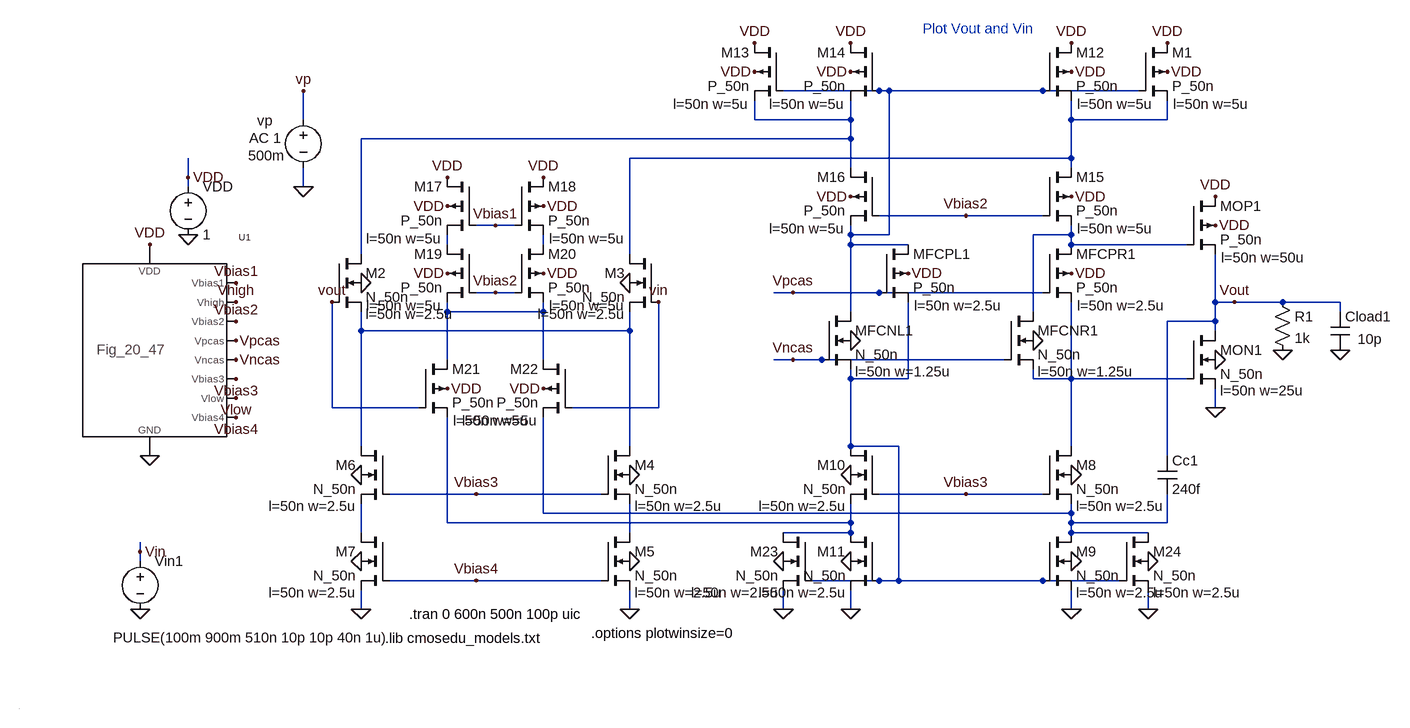
[diagram p0: schematic Fig24_49.asc]
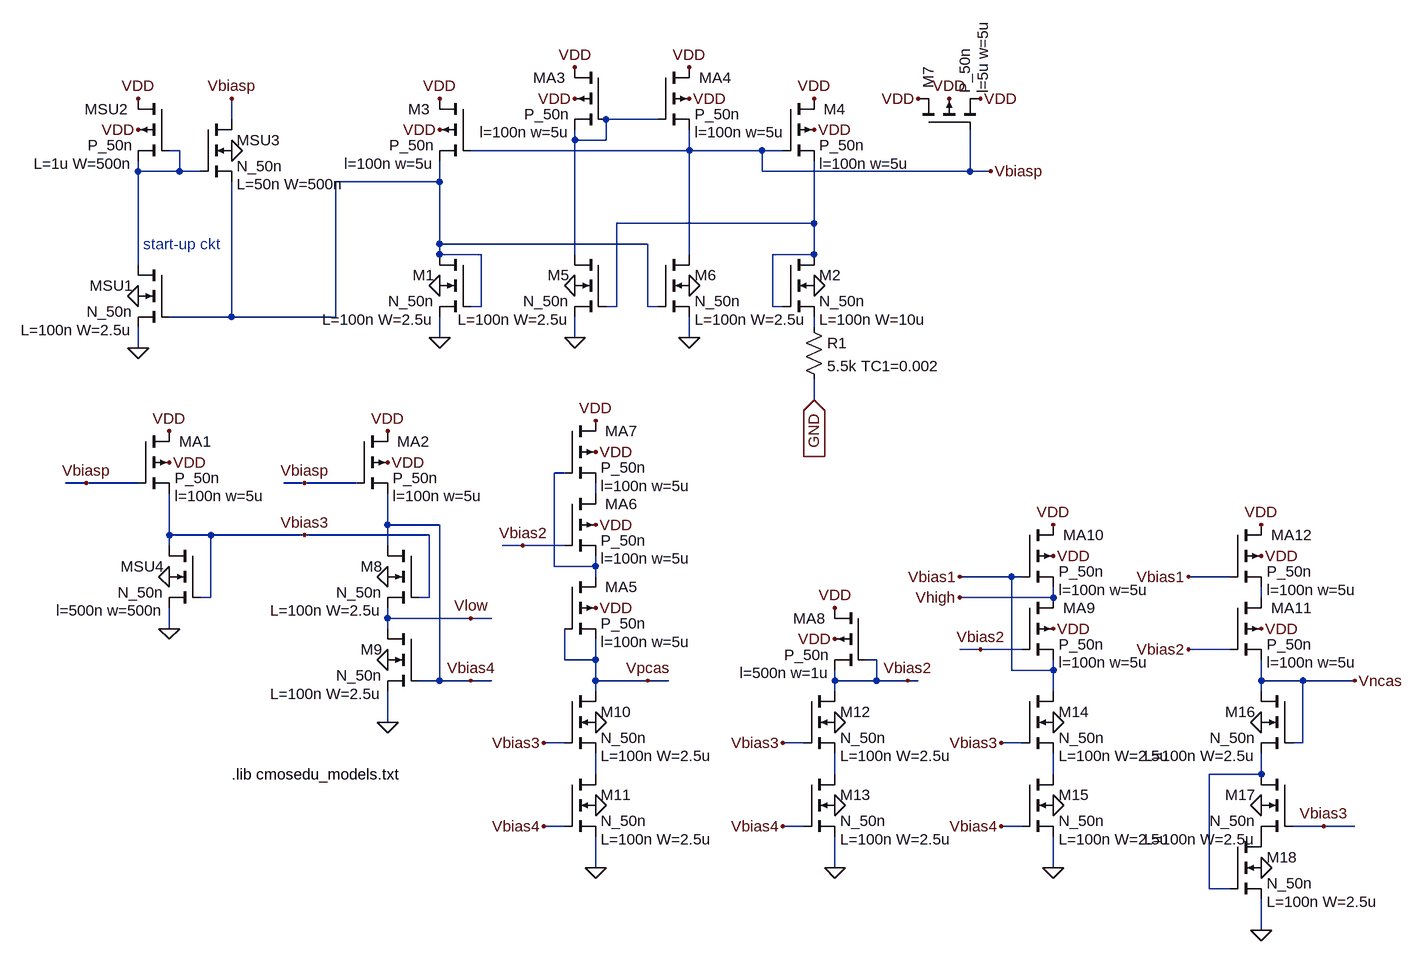
[diagram p1: sub-circuit fig_20_47.asc]
Fig24_49.asc, the LTspice schematic file:
Version 4
SHEET 1 3376 680
WIRE 2512 -1120 2352 -1120
WIRE 2528 -1120 2512 -1120
WIRE 2784 -1120 2528 -1120
WIRE 2944 -1120 2784 -1120
WIRE 1552 -1072 1552 -1120
WIRE 2304 -1072 2304 -1104
WIRE 2464 -1072 2464 -1104
WIRE 2464 -1072 2304 -1072
WIRE 2832 -1072 2832 -1104
WIRE 2992 -1072 2992 -1104
WIRE 2992 -1072 2832 -1072
WIRE 2464 -1040 2464 -1072
WIRE 2464 -1040 1648 -1040
WIRE 2832 -1008 2832 -1072
WIRE 2832 -1008 2096 -1008
WIRE 2464 -992 2464 -1040
WIRE 2832 -992 2832 -1008
WIRE 1360 -976 1360 -1008
WIRE 1360 -960 1360 -976
WIRE 1552 -960 1552 -992
WIRE 2656 -912 2512 -912
WIRE 2784 -912 2656 -912
WIRE 1872 -896 1840 -896
WIRE 1904 -896 1872 -896
WIRE 2464 -880 2464 -896
WIRE 2528 -880 2528 -1120
WIRE 2528 -880 2464 -880
WIRE 2832 -880 2832 -896
WIRE 2832 -880 2768 -880
WIRE 1792 -864 1792 -880
WIRE 1952 -864 1952 -880
WIRE 2464 -864 2464 -880
WIRE 2560 -864 2464 -864
WIRE 2832 -864 2832 -880
WIRE 3024 -864 2832 -864
WIRE 1648 -848 1648 -1040
WIRE 2096 -848 2096 -1008
WIRE 1872 -784 1840 -784
WIRE 1904 -784 1872 -784
WIRE 2368 -784 2336 -784
WIRE 2512 -784 2368 -784
WIRE 2784 -784 2512 -784
WIRE 3072 -768 3072 -848
WIRE 3104 -768 3072 -768
WIRE 3184 -768 3104 -768
WIRE 3280 -768 3184 -768
WIRE 1792 -752 1792 -768
WIRE 1952 -752 1952 -768
WIRE 1952 -752 1792 -752
WIRE 2464 -752 2464 -864
WIRE 2768 -752 2768 -880
WIRE 3280 -752 3280 -768
WIRE 3072 -736 3072 -768
WIRE 3072 -736 2992 -736
WIRE 1648 -720 1648 -752
WIRE 2096 -720 2096 -752
WIRE 2096 -720 1648 -720
WIRE 3072 -720 3072 -736
WIRE 1792 -672 1792 -752
WIRE 1952 -672 1952 -752
WIRE 2368 -672 2336 -672
WIRE 2416 -672 2368 -672
WIRE 2720 -672 2416 -672
WIRE 2464 -640 2464 -656
WIRE 2560 -640 2560 -768
WIRE 2560 -640 2464 -640
WIRE 2768 -640 2768 -656
WIRE 2832 -640 2832 -768
WIRE 2832 -640 2768 -640
WIRE 3024 -640 2832 -640
WIRE 1600 -592 1600 -768
WIRE 1744 -592 1600 -592
WIRE 2144 -592 2144 -768
WIRE 2144 -592 2000 -592
WIRE 3072 -592 3072 -624
WIRE 1792 -400 1792 -576
WIRE 1648 -528 1648 -720
WIRE 2096 -528 2096 -720
WIRE 2464 -528 2464 -640
WIRE 2544 -528 2464 -528
WIRE 2832 -528 2832 -640
WIRE 2992 -512 2992 -736
WIRE 1840 -448 1696 -448
WIRE 2048 -448 1840 -448
WIRE 2656 -448 2512 -448
WIRE 2784 -448 2656 -448
WIRE 1952 -416 1952 -576
WIRE 2832 -416 2832 -432
WIRE 2832 -416 1952 -416
WIRE 2464 -400 2464 -432
WIRE 2464 -400 1792 -400
WIRE 2832 -400 2832 -416
WIRE 2992 -400 2992 -448
WIRE 2992 -400 2832 -400
WIRE 1648 -384 1648 -432
WIRE 2096 -384 2096 -432
WIRE 2464 -384 2464 -400
WIRE 2464 -384 2352 -384
WIRE 2832 -384 2832 -400
WIRE 2960 -384 2832 -384
WIRE 1280 -352 1280 -368
WIRE 1280 -336 1280 -352
WIRE 1840 -304 1696 -304
WIRE 2048 -304 1840 -304
WIRE 2512 -304 2400 -304
WIRE 2544 -304 2544 -528
WIRE 2544 -304 2512 -304
WIRE 2784 -304 2544 -304
WIRE 2912 -304 2784 -304
WIRE 1648 -256 1648 -288
WIRE 2096 -256 2096 -288
WIRE 2352 -256 2352 -288
WIRE 2464 -256 2464 -288
WIRE 2832 -256 2832 -288
WIRE 2960 -256 2960 -288
WIRE 0 0 0 0
FLAG 1360 -880 0
FLAG 1360 -976 VDD
FLAG 1296 -864 VDD
FLAG 1296 -512 0
FLAG 1440 -800 Vbias1
FLAG 1440 -768 Vhigh
FLAG 1440 -736 Vbias2
FLAG 1440 -640 Vbias3
FLAG 1440 -704 Vpcas
FLAG 1440 -672 Vncas
FLAG 1440 -576 Vbias4
FLAG 1440 -608 Vlow
FLAG 1552 -960 0
FLAG 1552 -1120 vp
FLAG 1280 -256 0
FLAG 1280 -352 Vin
FLAG 2992 -1152 VDD
FLAG 1648 -800 0
FLAG 2096 -800 0
FLAG 1600 -768 vout
FLAG 2144 -768 vin
FLAG 2096 -480 0
FLAG 2096 -336 0
FLAG 2096 -256 0
FLAG 1648 -480 0
FLAG 1648 -336 0
FLAG 1648 -256 0
FLAG 1840 -448 Vbias3
FLAG 1840 -304 Vbias4
FLAG 2832 -480 0
FLAG 2832 -336 0
FLAG 2832 -256 0
FLAG 2464 -480 0
FLAG 2464 -336 0
FLAG 2464 -256 0
FLAG 2656 -448 Vbias3
FLAG 2832 -1152 VDD
FLAG 2832 -1200 VDD
FLAG 2992 -1200 VDD
FLAG 2304 -1152 VDD
FLAG 2464 -1152 VDD
FLAG 2464 -1200 VDD
FLAG 2304 -1200 VDD
FLAG 2832 -944 VDD
FLAG 2464 -944 VDD
FLAG 2656 -912 Vbias2
FLAG 3280 -688 0
FLAG 3104 -768 Vout
FLAG 2560 -816 VDD
FLAG 2832 -816 VDD
FLAG 2768 -704 0
FLAG 2464 -704 0
FLAG 2368 -784 Vpcas
FLAG 2368 -672 Vncas
FLAG 3072 -896 VDD
FLAG 3072 -944 VDD
FLAG 3072 -672 0
FLAG 3072 -592 0
FLAG 1792 -928 VDD
FLAG 1792 -976 VDD
FLAG 1952 -928 VDD
FLAG 1952 -976 VDD
FLAG 1792 -816 VDD
FLAG 1952 -816 VDD
FLAG 1872 -896 Vbias1
FLAG 1872 -784 Vbias2
FLAG 1792 -624 VDD
FLAG 1952 -624 VDD
FLAG 2352 -336 0
FLAG 2352 -256 0
FLAG 2960 -336 0
FLAG 2960 -256 0
FLAG 3184 -688 0
SYMBOL voltage 1360 -976 R0
WINDOW 123 0 0 Left 0
WINDOW 39 0 0 Left 0
SYMATTR InstName VDD
SYMATTR Value 1
SYMBOL Fig_20_47 1296 -688 R0
SYMATTR InstName U1
SYMBOL voltage 1552 -1088 R0
WINDOW 0 -77 18 Left 0
WINDOW 3 -92 76 Left 0
WINDOW 123 -90 47 Left 0
WINDOW 39 0 0 Left 0
SYMATTR InstName vp
SYMATTR Value 500m
SYMATTR Value2 AC 1
SYMBOL voltage 1280 -352 R0
WINDOW 3 -45 143 Left 0
WINDOW 123 0 0 Left 0
WINDOW 39 0 0 Left 0
SYMATTR Value PULSE(100m 900m 510n 10p 10p 40n 1u)
SYMATTR InstName Vin1
SYMBOL pmos4 2944 -1200 R0
WINDOW 123 58 102 Left 0
WINDOW 0 56 16 Left 0
SYMATTR Value2 l=50n w=5u
SYMATTR InstName M1
SYMATTR Value P_50n
SYMBOL nmos4 1600 -848 R0
WINDOW 123 56 100 Left 0
SYMATTR Value2 l=50n w=2.5u
SYMATTR InstName M2
SYMATTR Value N_50n
SYMBOL nmos4 2144 -848 M0
WINDOW 123 56 100 Left 0
SYMATTR Value2 l=50n w=2.5u
SYMATTR InstName M3
SYMATTR Value N_50n
SYMBOL nmos4 2048 -528 R0
WINDOW 123 56 100 Left 0
SYMATTR Value2 l=50n w=2.5u
SYMATTR InstName M4
SYMATTR Value N_50n
SYMBOL nmos4 2048 -384 R0
WINDOW 123 56 100 Left 0
SYMATTR Value2 l=50n w=2.5u
SYMATTR InstName M5
SYMATTR Value N_50n
SYMBOL nmos4 1696 -528 M0
WINDOW 123 56 100 Left 0
SYMATTR Value2 l=50n w=2.5u
SYMATTR InstName M6
SYMATTR Value N_50n
SYMBOL nmos4 1696 -384 M0
WINDOW 123 56 100 Left 0
SYMATTR Value2 l=50n w=2.5u
SYMATTR InstName M7
SYMATTR Value N_50n
SYMBOL nmos4 2784 -528 R0
WINDOW 123 56 100 Left 0
SYMATTR Value2 l=50n w=2.5u
SYMATTR InstName M8
SYMATTR Value N_50n
SYMBOL nmos4 2784 -384 R0
WINDOW 123 56 100 Left 0
SYMATTR Value2 l=50n w=2.5u
SYMATTR InstName M9
SYMATTR Value N_50n
SYMBOL nmos4 2512 -528 M0
WINDOW 123 56 100 Left 0
SYMATTR Value2 l=50n w=2.5u
SYMATTR InstName M10
SYMATTR Value N_50n
SYMBOL nmos4 2512 -384 M0
WINDOW 123 56 100 Left 0
SYMATTR Value2 l=50n w=2.5u
SYMATTR InstName M11
SYMATTR Value N_50n
SYMBOL pmos4 2784 -1200 R0
WINDOW 123 58 102 Left 0
WINDOW 0 56 16 Left 0
SYMATTR Value2 l=50n w=5u
SYMATTR InstName M12
SYMATTR Value P_50n
SYMBOL pmos4 2352 -1200 M0
WINDOW 123 58 102 Left 0
WINDOW 0 56 16 Left 0
SYMATTR Value2 l=50n w=5u
SYMATTR InstName M13
SYMATTR Value P_50n
SYMBOL pmos4 2512 -1200 M0
WINDOW 123 58 102 Left 0
WINDOW 0 56 16 Left 0
SYMATTR Value2 l=50n w=5u
SYMATTR InstName M14
SYMATTR Value P_50n
SYMBOL pmos4 2784 -992 R0
WINDOW 123 58 102 Left 0
WINDOW 0 56 16 Left 0
SYMATTR Value2 l=50n w=5u
SYMATTR InstName M15
SYMATTR Value P_50n
SYMBOL pmos4 2512 -992 M0
WINDOW 123 58 102 Left 0
WINDOW 0 56 16 Left 0
SYMATTR Value2 l=50n w=5u
SYMATTR InstName M16
SYMATTR Value P_50n
SYMBOL cap 3264 -752 R0
WINDOW 3 45 46 Left 0
SYMATTR Value 10p
SYMATTR InstName Cload1
SYMBOL pmos4 2512 -864 R0
WINDOW 123 58 102 Left 0
WINDOW 0 56 16 Left 0
SYMATTR Value2 l=50n w=2.5u
SYMATTR InstName MFCPL1
SYMATTR Value P_50n
SYMBOL pmos4 2784 -864 R0
WINDOW 123 58 102 Left 0
WINDOW 0 56 16 Left 0
SYMATTR Value2 l=50n w=2.5u
SYMATTR InstName MFCPR1
SYMATTR Value P_50n
SYMBOL nmos4 2720 -752 R0
WINDOW 123 56 100 Left 0
SYMATTR Value2 l=50n w=1.25u
SYMATTR InstName MFCNR1
SYMATTR Value N_50n
SYMBOL nmos4 2416 -752 R0
WINDOW 123 56 100 Left 0
SYMATTR Value2 l=50n w=1.25u
SYMATTR InstName MFCNL1
SYMATTR Value N_50n
SYMBOL pmos4 3024 -944 R0
WINDOW 123 58 102 Left 0
WINDOW 0 56 16 Left 0
SYMATTR Value2 l=50n w=50u
SYMATTR InstName MOP1
SYMATTR Value P_50n
SYMBOL nmos4 3024 -720 R0
WINDOW 123 56 100 Left 0
SYMATTR Value2 l=50n w=25u
SYMATTR InstName MON1
SYMATTR Value N_50n
SYMBOL cap 2976 -512 R0
SYMATTR InstName Cc1
SYMATTR Value 240f
SYMBOL pmos4 1840 -976 M0
WINDOW 123 58 102 Left 0
WINDOW 0 56 16 Left 0
SYMATTR Value2 l=50n w=5u
SYMATTR InstName M17
SYMATTR Value P_50n
SYMBOL pmos4 1904 -976 R0
WINDOW 123 58 102 Left 0
WINDOW 0 56 16 Left 0
SYMATTR Value2 l=50n w=5u
SYMATTR InstName M18
SYMATTR Value P_50n
SYMBOL pmos4 1840 -864 M0
WINDOW 123 58 102 Left 0
WINDOW 0 56 16 Left 0
SYMATTR Value2 l=50n w=5u
SYMATTR InstName M19
SYMATTR Value P_50n
SYMBOL pmos4 1904 -864 R0
WINDOW 123 58 102 Left 0
WINDOW 0 56 16 Left 0
SYMATTR Value2 l=50n w=5u
SYMATTR InstName M20
SYMATTR Value P_50n
SYMBOL pmos4 1744 -672 R0
WINDOW 123 58 102 Left 0
WINDOW 0 56 16 Left 0
SYMATTR Value2 l=50n w=5u
SYMATTR InstName M21
SYMATTR Value P_50n
SYMBOL pmos4 2000 -672 M0
WINDOW 123 58 102 Left 0
WINDOW 0 56 16 Left 0
SYMATTR Value2 l=50n w=5u
SYMATTR InstName M22
SYMATTR Value P_50n
SYMBOL nmos4 2400 -384 M0
WINDOW 123 56 100 Left 0
SYMATTR Value2 l=50n w=2.5u
SYMATTR InstName M23
SYMATTR Value N_50n
SYMBOL nmos4 2912 -384 R0
WINDOW 123 56 100 Left 0
SYMATTR Value2 l=50n w=2.5u
SYMATTR InstName M24
SYMATTR Value N_50n
SYMBOL res 3168 -784 R0
SYMATTR InstName R1
SYMATTR Value 1k
TEXT 1688 -208 Left 0 !.lib cmosedu_models.txt
TEXT 1728 -248 Left 0 !.tran 0 600n 500n 100p uic
TEXT 2584 -1224 Left 0 ;Plot Vout and Vin
TEXT 2032 -216 Left 0 !.options plotwinsize=0

fig_20_47.asc, the sub-circuit schematic file:
Version 4
SHEET 1 2508 1124
WIRE 464 416 432 416
WIRE 544 -64 544 -80
WIRE 544 80 544 -64
WIRE 544 208 544 176
WIRE 544 416 464 416
WIRE 592 496 592 432
WIRE 592 512 592 496
WIRE 592 640 592 608
WIRE 608 -96 592 -96
WIRE 608 -64 544 -64
WIRE 608 -64 608 -96
WIRE 640 -64 608 -64
WIRE 656 496 592 496
WIRE 656 592 640 592
WIRE 656 592 656 496
WIRE 688 -144 688 -176
WIRE 688 160 592 160
WIRE 688 160 688 -48
WIRE 800 416 768 416
WIRE 800 496 656 496
WIRE 848 160 688 160
WIRE 848 160 848 -48
WIRE 880 416 800 416
WIRE 928 480 928 432
WIRE 928 512 928 480
WIRE 928 624 928 608
WIRE 928 640 928 624
WIRE 928 784 928 736
WIRE 992 496 800 496
WIRE 992 592 976 592
WIRE 992 592 992 496
WIRE 1008 -48 848 -48
WIRE 1008 -48 1008 -80
WIRE 1008 48 1008 -48
WIRE 1008 64 1008 48
WIRE 1008 192 1008 160
WIRE 1008 480 928 480
WIRE 1008 720 976 720
WIRE 1008 720 1008 480
WIRE 1056 624 928 624
WIRE 1056 720 1008 720
WIRE 1072 64 1008 64
WIRE 1072 144 1056 144
WIRE 1072 144 1072 64
WIRE 1088 624 1056 624
WIRE 1088 720 1056 720
WIRE 1136 512 1104 512
WIRE 1184 544 1184 400
WIRE 1200 400 1184 400
WIRE 1200 512 1136 512
WIRE 1200 688 1200 640
WIRE 1200 816 1168 816
WIRE 1200 944 1168 944
WIRE 1216 -112 1216 -128
WIRE 1216 64 1216 -112
WIRE 1216 192 1216 160
WIRE 1248 432 1248 416
WIRE 1248 544 1184 544
WIRE 1248 544 1248 528
WIRE 1248 560 1248 544
WIRE 1248 688 1200 688
WIRE 1248 688 1248 656
WIRE 1248 720 1248 688
WIRE 1248 736 1248 720
WIRE 1248 864 1248 832
WIRE 1248 1008 1248 960
WIRE 1264 -112 1216 -112
WIRE 1264 -112 1264 -144
WIRE 1280 144 1264 144
WIRE 1280 144 1280 16
WIRE 1328 48 1008 48
WIRE 1328 144 1328 48
WIRE 1328 720 1248 720
WIRE 1344 -144 1264 -144
WIRE 1344 144 1328 144
WIRE 1360 720 1328 720
WIRE 1392 -96 1056 -96
WIRE 1392 -96 1392 -128
WIRE 1392 64 1392 -96
WIRE 1392 192 1392 160
WIRE 1504 -96 1392 -96
WIRE 1504 -64 1504 -96
WIRE 1520 144 1520 64
WIRE 1536 -96 1504 -96
WIRE 1536 144 1520 144
WIRE 1568 816 1536 816
WIRE 1568 944 1536 944
WIRE 1584 16 1280 16
WIRE 1584 16 1584 -80
WIRE 1584 64 1520 64
WIRE 1584 64 1584 16
WIRE 1584 176 1584 160
WIRE 1584 288 1584 256
WIRE 1616 720 1616 704
WIRE 1616 736 1616 720
WIRE 1616 864 1616 832
WIRE 1616 1008 1616 960
WIRE 1680 688 1664 688
WIRE 1680 720 1616 720
WIRE 1680 720 1680 688
WIRE 1728 720 1680 720
WIRE 1744 720 1728 720
WIRE 1824 -64 1504 -64
WIRE 1824 -64 1824 -128
WIRE 1840 672 1808 672
WIRE 1856 -64 1824 -64
WIRE 1888 560 1808 560
WIRE 1888 704 1888 560
WIRE 1904 560 1888 560
WIRE 1904 672 1840 672
WIRE 1904 816 1872 816
WIRE 1904 944 1872 944
WIRE 1952 592 1808 592
WIRE 1952 592 1952 576
WIRE 1952 704 1888 704
WIRE 1952 704 1952 688
WIRE 1952 736 1952 704
WIRE 1952 864 1952 832
WIRE 1952 1008 1952 960
WIRE 2192 1040 2192 864
WIRE 2224 560 2160 560
WIRE 2224 672 2160 672
WIRE 2224 1040 2192 1040
WIRE 2272 592 2272 576
WIRE 2272 720 2272 688
WIRE 2272 736 2272 720
WIRE 2272 864 2192 864
WIRE 2272 864 2272 832
WIRE 2272 880 2272 864
WIRE 2272 1104 2272 1056
WIRE 2336 720 2272 720
WIRE 2336 816 2320 816
WIRE 2336 816 2336 720
WIRE 2368 944 2320 944
WIRE 2416 720 2336 720
WIRE 2416 944 2368 944
FLAG 544 -128 VDD
FLAG 544 -176 VDD
FLAG 544 208 0
FLAG 544 128 0
FLAG 688 -96 0
FLAG 688 -176 Vbiasp
FLAG 1008 -128 VDD
FLAG 1008 -176 VDD
FLAG 1584 -128 VDD
FLAG 1584 -176 VDD
FLAG 1856 -64 Vbiasp
FLAG 1008 192 0
FLAG 1008 112 0
FLAG 1584 112 0
FLAG 1392 -176 VDD
FLAG 1392 -224 VDD
FLAG 1216 -176 VDD
FLAG 1216 -224 VDD
FLAG 1216 112 0
FLAG 1392 112 0
FLAG 1216 192 0
FLAG 1392 192 0
FLAG 1792 -176 VDD
FLAG 1744 -176 VDD
FLAG 1840 -176 VDD
FLAG 592 384 VDD
FLAG 592 336 VDD
FLAG 464 416 Vbiasp
FLAG 928 384 VDD
FLAG 928 336 VDD
FLAG 800 416 Vbiasp
FLAG 592 640 0
FLAG 592 560 0
FLAG 928 560 0
FLAG 928 688 0
FLAG 928 784 0
FLAG 800 496 Vbias3
FLAG 1248 784 0
FLAG 1248 912 0
FLAG 1248 1008 0
FLAG 1056 624 Vlow
FLAG 1056 720 Vbias4
FLAG 1168 816 Vbias3
FLAG 1168 944 Vbias4
FLAG 1616 784 0
FLAG 1616 912 0
FLAG 1616 1008 0
FLAG 1536 816 Vbias3
FLAG 1536 944 Vbias4
FLAG 1952 784 0
FLAG 1952 912 0
FLAG 1952 1008 0
FLAG 1872 816 Vbias3
FLAG 1872 944 Vbias4
FLAG 1248 608 VDD
FLAG 1328 720 Vpcas
FLAG 1248 480 VDD
FLAG 1248 368 VDD
FLAG 1248 320 VDD
FLAG 1136 512 Vbias2
FLAG 1616 656 VDD
FLAG 1616 608 VDD
FLAG 1728 720 Vbias2
FLAG 1952 640 VDD
FLAG 1952 528 VDD
FLAG 1952 480 VDD
FLAG 1840 672 Vbias2
FLAG 1808 560 Vbias1
FLAG 1808 592 Vhigh
FLAG 2272 640 VDD
FLAG 2272 528 VDD
FLAG 2272 480 VDD
FLAG 2160 560 Vbias1
FLAG 2160 672 Vbias2
FLAG 2272 784 0
FLAG 2272 912 0
FLAG 2272 1008 0
FLAG 2272 1104 0
FLAG 2416 720 Vncas
FLAG 2368 944 Vbias3
FLAG 1584 288 GND
IOPIN 1584 288 In
SYMBOL pmos4 592 -176 M0
WINDOW 0 63 16 Left 0
WINDOW 123 56 100 Left 0
SYMATTR InstName MSU2
SYMATTR Value2 L=1u W=500n
SYMATTR Value P_50n
SYMBOL nmos4 592 80 M0
WINDOW 123 56 100 Left 0
SYMATTR Value2 L=100n W=2.5u
SYMATTR InstName MSU1
SYMATTR Value N_50n
SYMBOL nmos4 640 -144 R0
WINDOW 123 56 100 Left 0
SYMATTR Value2 L=50n W=500n
SYMATTR InstName MSU3
SYMATTR Value N_50n
SYMBOL pmos4 1056 -176 M0
WINDOW 0 63 16 Left 0
WINDOW 123 56 100 Left 0
SYMATTR InstName M3
SYMATTR Value2 l=100n w=5u
SYMATTR Value P_50n
SYMBOL pmos4 1536 -176 R0
WINDOW 0 63 16 Left 0
WINDOW 123 56 100 Left 0
SYMATTR InstName M4
SYMATTR Value2 l=100n w=5u
SYMATTR Value P_50n
SYMBOL nmos4 1056 64 M0
WINDOW 123 56 100 Left 0
SYMATTR Value2 L=100n W=2.5u
SYMATTR InstName M1
SYMATTR Value N_50n
SYMBOL nmos4 1536 64 R0
WINDOW 123 56 100 Left 0
SYMATTR Value2 L=100n W=10u
SYMATTR InstName M2
SYMATTR Value N_50n
SYMBOL res 1568 160 R0
SYMATTR InstName R1
SYMATTR Value 5.5k TC1=0.002
SYMBOL pmos4 1344 -224 R0
WINDOW 0 63 16 Left 0
WINDOW 123 56 100 Left 0
SYMATTR InstName MA4
SYMATTR Value2 l=100n w=5u
SYMATTR Value P_50n
SYMBOL pmos4 1264 -224 M0
WINDOW 0 63 16 Left 0
WINDOW 123 56 100 Left 0
SYMATTR InstName MA3
SYMATTR Value2 l=100n w=5u
SYMATTR Value P_50n
SYMBOL nmos4 1264 64 M0
WINDOW 123 56 100 Left 0
SYMATTR Value2 L=100n W=2.5u
SYMATTR InstName M5
SYMATTR Value N_50n
SYMBOL nmos4 1344 64 R0
WINDOW 123 56 100 Left 0
SYMATTR Value2 L=100n W=2.5u
SYMATTR InstName M6
SYMATTR Value N_50n
SYMBOL pmos4 1744 -128 R270
WINDOW 0 63 16 Left 0
WINDOW 123 56 100 Left 0
SYMATTR InstName M7
SYMATTR Value2 l=5u w=5u
SYMATTR Value P_50n
SYMBOL pmos4 544 336 R0
WINDOW 0 63 16 Left 0
WINDOW 123 56 100 Left 0
SYMATTR InstName MA1
SYMATTR Value2 l=100n w=5u
SYMATTR Value P_50n
SYMBOL pmos4 880 336 R0
WINDOW 0 63 16 Left 0
WINDOW 123 56 100 Left 0
SYMATTR InstName MA2
SYMATTR Value2 l=100n w=5u
SYMATTR Value P_50n
SYMBOL nmos4 640 512 M0
WINDOW 123 56 100 Left 0
SYMATTR Value2 l=500n w=500n
SYMATTR InstName MSU4
SYMATTR Value N_50n
SYMBOL nmos4 976 512 M0
WINDOW 123 56 100 Left 0
SYMATTR Value2 L=100n W=2.5u
SYMATTR InstName M8
SYMATTR Value N_50n
SYMBOL nmos4 976 640 M0
WINDOW 123 56 100 Left 0
SYMATTR Value2 L=100n W=2.5u
SYMATTR InstName M9
SYMATTR Value N_50n
SYMBOL nmos4 1200 736 R0
WINDOW 123 56 100 Left 0
SYMATTR Value2 L=100n W=2.5u
SYMATTR InstName M10
SYMATTR Value N_50n
SYMBOL nmos4 1200 864 R0
WINDOW 123 56 100 Left 0
SYMATTR Value2 L=100n W=2.5u
SYMATTR InstName M11
SYMATTR Value N_50n
SYMBOL nmos4 1568 736 R0
WINDOW 123 56 100 Left 0
SYMATTR Value2 L=100n W=2.5u
SYMATTR InstName M12
SYMATTR Value N_50n
SYMBOL nmos4 1568 864 R0
WINDOW 123 56 100 Left 0
SYMATTR Value2 L=100n W=2.5u
SYMATTR InstName M13
SYMATTR Value N_50n
SYMBOL nmos4 1904 736 R0
WINDOW 123 56 100 Left 0
SYMATTR Value2 L=100n W=2.5u
SYMATTR InstName M14
SYMATTR Value N_50n
SYMBOL nmos4 1904 864 R0
WINDOW 123 56 100 Left 0
SYMATTR Value2 L=100n W=2.5u
SYMATTR InstName M15
SYMATTR Value N_50n
SYMBOL pmos4 1200 560 R0
WINDOW 0 63 16 Left 0
WINDOW 123 56 100 Left 0
SYMATTR InstName MA5
SYMATTR Value2 l=100n w=5u
SYMATTR Value P_50n
SYMBOL pmos4 1200 432 R0
WINDOW 0 63 16 Left 0
WINDOW 123 56 100 Left 0
SYMATTR InstName MA6
SYMATTR Value2 l=100n w=5u
SYMATTR Value P_50n
SYMBOL pmos4 1200 320 R0
WINDOW 0 63 16 Left 0
WINDOW 123 56 100 Left 0
SYMATTR InstName MA7
SYMATTR Value2 l=100n w=5u
SYMATTR Value P_50n
SYMBOL pmos4 1664 608 M0
WINDOW 0 63 16 Left 0
WINDOW 123 56 100 Left 0
SYMATTR InstName MA8
SYMATTR Value2 l=500n w=1u
SYMATTR Value P_50n
SYMBOL pmos4 1904 592 R0
WINDOW 0 63 16 Left 0
WINDOW 123 56 100 Left 0
SYMATTR InstName MA9
SYMATTR Value2 l=100n w=5u
SYMATTR Value P_50n
SYMBOL pmos4 1904 480 R0
WINDOW 0 63 16 Left 0
WINDOW 123 56 100 Left 0
SYMATTR InstName MA10
SYMATTR Value2 l=100n w=5u
SYMATTR Value P_50n
SYMBOL pmos4 2224 592 R0
WINDOW 0 63 16 Left 0
WINDOW 123 56 100 Left 0
SYMATTR InstName MA11
SYMATTR Value2 l=100n w=5u
SYMATTR Value P_50n
SYMBOL pmos4 2224 480 R0
WINDOW 0 63 16 Left 0
WINDOW 123 56 100 Left 0
SYMATTR InstName MA12
SYMATTR Value2 l=100n w=5u
SYMATTR Value P_50n
SYMBOL nmos4 2320 736 M0
WINDOW 123 56 100 Left 0
SYMATTR Value2 L=100n W=2.5u
SYMATTR InstName M16
SYMATTR Value N_50n
SYMBOL nmos4 2320 864 M0
WINDOW 123 56 100 Left 0
SYMATTR Value2 L=100n W=2.5u
SYMATTR InstName M17
SYMATTR Value N_50n
SYMBOL nmos4 2224 960 R0
WINDOW 123 56 100 Left 0
SYMATTR Value2 L=100n W=2.5u
SYMATTR InstName M18
SYMATTR Value N_50n
TEXT 552 48 Left 0 ;start-up ckt
TEXT 688 864 Left 0 !.lib cmosedu_models.txt

The netlist it stands for:
* Fig24_49.asc
VDD VDD 0 1
XU1 Vbias1 Vhigh Vbias2 Vpcas Vncas Vbias3 Vlow Vbias4 VDD 0 fig_20_47
vp vp 0 500m AC 1
Vin1 Vin 0 PULSE(100m 900m 510n 10p 10p 40n 1u)
M1 VDD N001 N003 VDD P_50n l=50n w=5u
M2 N002 vout N008 0 N_50n l=50n w=2.5u
M3 N003 Vin N008 0 N_50n l=50n w=2.5u
M4 N008 Vbias3 N014 0 N_50n l=50n w=2.5u
M5 N014 Vbias4 0 0 N_50n l=50n w=2.5u
M6 N008 Vbias3 N013 0 N_50n l=50n w=2.5u
M7 N013 Vbias4 0 0 N_50n l=50n w=2.5u
M8 N010 Vbias3 N012 0 N_50n l=50n w=2.5u
M9 N012 N009 0 0 N_50n l=50n w=2.5u
M10 N009 Vbias3 N011 0 N_50n l=50n w=2.5u
M11 N011 N009 0 0 N_50n l=50n w=2.5u
M12 VDD N001 N003 VDD P_50n l=50n w=5u
M13 VDD N001 N002 VDD P_50n l=50n w=5u
M14 VDD N001 N002 VDD P_50n l=50n w=5u
M15 N003 Vbias2 N004 VDD P_50n l=50n w=5u
M16 N002 Vbias2 N001 VDD P_50n l=50n w=5u
Cload1 vout 0 10p
MFCPL1 N001 Vpcas N009 VDD P_50n l=50n w=2.5u
MFCPR1 N004 Vpcas N010 VDD P_50n l=50n w=2.5u
MFCNR1 N004 Vncas N010 0 N_50n l=50n w=1.25u
MFCNL1 N001 Vncas N009 0 N_50n l=50n w=1.25u
MOP1 VDD N004 vout VDD P_50n l=50n w=50u
MON1 vout N010 0 0 N_50n l=50n w=25u
Cc1 vout N012 240f
M17 VDD Vbias1 N005 VDD P_50n l=50n w=5u
M18 VDD Vbias1 N006 VDD P_50n l=50n w=5u
M19 N005 Vbias2 N007 VDD P_50n l=50n w=5u
M20 N006 Vbias2 N007 VDD P_50n l=50n w=5u
M21 N007 vout N011 VDD P_50n l=50n w=5u
M22 N007 Vin N012 VDD P_50n l=50n w=5u
M23 N011 N009 0 0 N_50n l=50n w=2.5u
M24 N012 N009 0 0 N_50n l=50n w=2.5u
R1 vout 0 1k

* block symbol definitions
.subckt fig_20_47 Vbias1 Vhigh Vbias2 Vpcas Vncas Vbias3 Vlow Vbias4 VDD GND
MSU2 VDD N001 N001 VDD P_50n L=1u W=500n
MSU1 N001 N002 0 0 N_50n L=100n W=2.5u
MSU3 Vbiasp N001 N002 0 N_50n L=50n W=500n
M3 VDD Vbiasp N002 VDD P_50n l=100n w=5u
M4 VDD Vbiasp N007 VDD P_50n l=100n w=5u
M1 N002 N002 0 0 N_50n L=100n W=2.5u
M2 N007 N007 N008 0 N_50n L=100n W=10u
R1 N008 GND 5.5k TC1=0.002
MA4 VDD N004 Vbiasp VDD P_50n l=100n w=5u
MA3 VDD N004 N004 VDD P_50n l=100n w=5u
M5 N004 N007 0 0 N_50n L=100n W=2.5u
M6 Vbiasp N002 0 0 N_50n L=100n W=2.5u
M7 VDD Vbiasp VDD VDD P_50n l=5u w=5u
MA1 VDD Vbiasp Vbias3 VDD P_50n l=100n w=5u
MA2 VDD Vbiasp Vbias4 VDD P_50n l=100n w=5u
MSU4 Vbias3 Vbias3 0 0 N_50n l=500n w=500n
M8 Vbias4 Vbias3 Vlow 0 N_50n L=100n W=2.5u
M9 Vlow Vbias4 0 0 N_50n L=100n W=2.5u
M10 Vpcas Vbias3 N006 0 N_50n L=100n W=2.5u
M11 N006 Vbias4 0 0 N_50n L=100n W=2.5u
M12 Vbias2 Vbias3 N009 0 N_50n L=100n W=2.5u
M13 N009 Vbias4 0 0 N_50n L=100n W=2.5u
M14 Vbias1 Vbias3 N010 0 N_50n L=100n W=2.5u
M15 N010 Vbias4 0 0 N_50n L=100n W=2.5u
MA5 N003 Vpcas Vpcas VDD P_50n l=100n w=5u
MA6 N005 Vbias2 N003 VDD P_50n l=100n w=5u
MA7 VDD N003 N005 VDD P_50n l=100n w=5u
MA8 VDD Vbias2 Vbias2 VDD P_50n l=500n w=1u
MA9 Vhigh Vbias2 Vbias1 VDD P_50n l=100n w=5u
MA10 VDD Vbias1 Vhigh VDD P_50n l=100n w=5u
MA11 N012 Vbias2 Vncas VDD P_50n l=100n w=5u
MA12 VDD Vbias1 N012 VDD P_50n l=100n w=5u
M16 Vncas Vncas N011 0 N_50n L=100n W=2.5u
M17 N011 Vbias3 P001 0 N_50n L=100n W=2.5u
M18 P001 N011 0 0 N_50n L=100n W=2.5u
* start-up ckt
.lib cmosedu_models.txt
.ends fig_20_47

.model NMOS NMOS
.model PMOS PMOS
.lib standard.mos
.lib cmosedu_models.txt
.tran 0 600n 500n 100p uic
* Plot Vout and Vin
.options plotwinsize=0
.backanno
.end